# EasyEDA Pro project ProPrj_2026_05_15_drone_2026-05-23.epro

# Schematic Schematic1
Board Name: Board1; Create Date: 2026-05-15; Page Name: P1; Project Name: 2026_05_15_drone; Schematic Name: Schematic1; Update Date: 2026-05-15; Company: EasyEDA.com; Page Size: A4; Version: V1.0
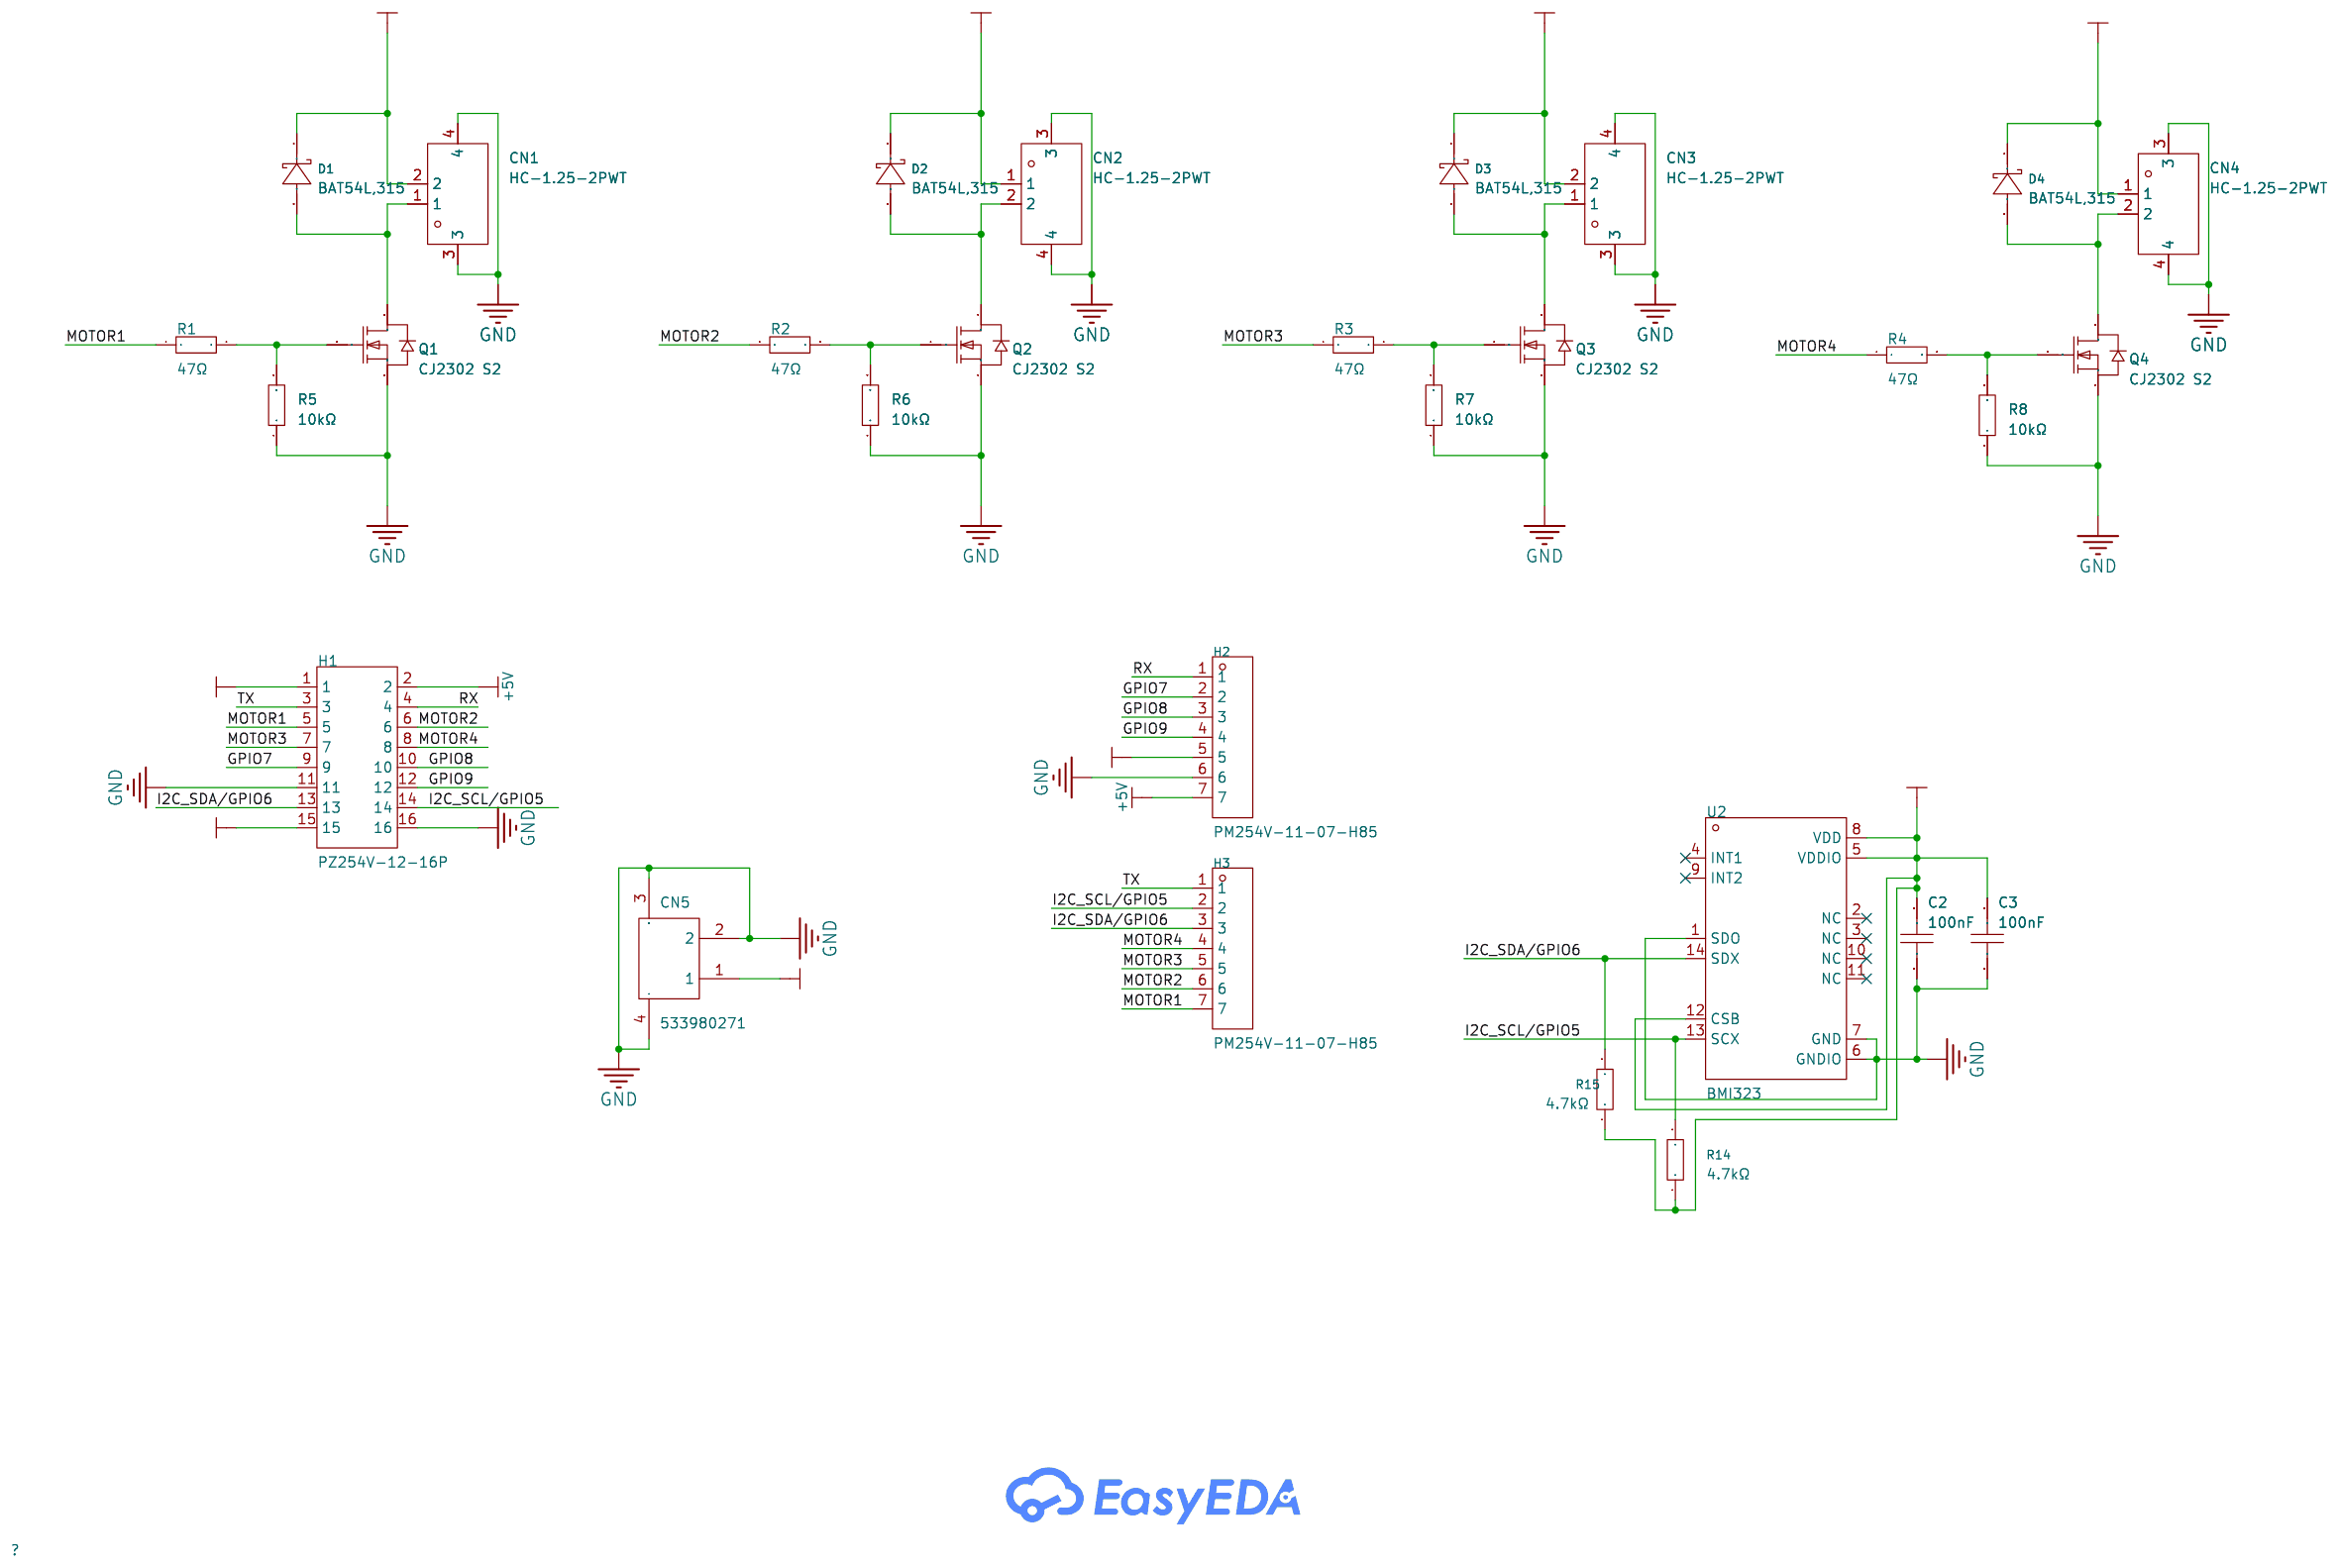
[diagram p0: schematic sheet]

## Parts
C2  100nF  [C0402]
C3  100nF  [C0402]
CN1  HC-1.25-2PWT  [CONN-SMD_2P-P1.25-HC-1.25-2PWT]
CN2  HC-1.25-2PWT  [CONN-SMD_2P-P1.25-HC-1.25-2PWT]
CN3  HC-1.25-2PWT  [CONN-SMD_2P-P1.25-HC-1.25-2PWT]
CN4  HC-1.25-2PWT  [CONN-SMD_2P-P1.25-HC-1.25-2PWT]
CN5  533980271  [CONN-SMD_2P-P1.25_053398-0X71]
D1  BAT54L,315  [DFN1006-2L-RD]
D2  BAT54L,315  [DFN1006-2L-RD]
D3  BAT54L,315  [DFN1006-2L-RD]
D4  BAT54L,315  [DFN1006-2L-RD]
H1  PZ254V-12-16P  [HDR-TH_16P-P2.54-V-M-R2-C8-S2.54]
H2  PM254V-11-07-H85  [HDR-TH_7P-P2.54-V-F]
H3  PM254V-11-07-H85  [HDR-TH_7P-P2.54-V-F]
Q1  CJ2302 S2  [SOT-23-3_L3.0-W1.7-P0.95-LS2.9-BR]
Q2  CJ2302 S2  [SOT-23-3_L3.0-W1.7-P0.95-LS2.9-BR]
Q3  CJ2302 S2  [SOT-23-3_L3.0-W1.7-P0.95-LS2.9-BR]
Q4  CJ2302 S2  [SOT-23-3_L3.0-W1.7-P0.95-LS2.9-BR]
R1  47Ω  [R0402]
R2  47Ω  [R0402]
R3  47Ω  [R0402]
R4  47Ω  [R0402]
R5  10kΩ  [R0402]
R6  10kΩ  [R0402]
R7  10kΩ  [R0402]
R8  10kΩ  [R0402]
R14  4.7kΩ  [R0402]
R15  4.7kΩ  [R0402]
U2  BMI323  [LGA-14_L3.0-W2.5-P0.50-TL_QMI8658A]

## Library data of the parts
C2 C3 = CL05B104KO5NNNC: Capacitance: Tolerance:±10% Tolerance:±10% Voltage Rated: Temperature Coefficient:; LCSC Part Name: 100nF ±10% 16V; Supplier Part: C1525; Manufacturer: SAMSUNG(三星); Supplier Footprint: 0402; JLCPCB Part Class: Basic Part; Datasheet: https://atta.szlcsc.com/upload/public/pdf/source/20160218/1457707763339.pdf; Supplier: LCSC; Tolerance: ±10%
CN1-CN4 = HC-1.25-2PWT: Pins Structure:1x2P Pitch:1.25mm Mounting Style:Horizontal attachment Reference Series:PicoBlade(MX 1.25) Number of Pins:2P Number of Rows:1 Number of PINs Per Row:2 Row Spacing:- Current Rating (Max):1A Contact Material:Brass Contact Plating:Tin Operatin; LCSC Part Name: 1x2P 间距:1.25mm 卧贴 系列:PicoBlade(MX 1.25); Supplier Part: C2845379; Manufacturer: HCTL(华灿天禄); Supplier Footprint: SMD,P=1.25mm,卧贴; JLCPCB Part Class: Extended Part; Datasheet: https://atta.szlcsc.com/upload/public/pdf/source/20240930/9508A8292CCC87B0C29E3A028D56E30A.pdf; Supplier: LCSC; Pins Structure: 1x2P; Pitch: 1.25mm; Mounting Style: Horizontal attachment; Reference Series: PicoBlade(MX 1.25); Number of Pins: 2P; Number of Rows: 1; Number of PINs Per Row: 2; Current Rating (Max): 1A; Contact Material: Brass; Contact Plating: Tin; Operating Temperature Range: -40℃~+105℃; Rated Voltage (Max): 125V; Plastic Material: LCP; Flame Retardant Rating: UL94V-0; Supplementary Features: Auxiliary soldering legs; Z-Height of the Board: 3.57mm; X-Length of Bottom Edge on Board (Spacing Line): 7.55mm; Y-Width of Bottom Edge on Board: 5.25mm
CN5 = 533980271_C122410: Pins Structure:1x2P Pitch:1.25mm Mounting Type:Surface Mount,Vertical Reference Series:PicoBlade(MX 1.25) Number of Pins:2P Number of Rows:1 Number of PINs Per Row:2 Row Spacing:- Current Rating:1A Contact Material:Phosphor Bronze Contact Plating:Tin Oper; LCSC Part Name: 1x2P 间距:1.25mm 立贴 系列:PicoBlade(MX 1.25); Supplier Part: C122410; Manufacturer: MOLEX; Supplier Footprint: SMD,P=1.25mm; JLCPCB Part Class: Extended Part; Datasheet: https://www.molex.com/content/dam/molex/molex-dot-com/products/automated/en-us/salesdrawingpdf/533/53398/533980271_sd.pdf?inline; Supplier: LCSC; Pins Structure: 1x2P; Pitch: 1.25mm; Mounting Type: Surface Mount,Vertical; Reference Series: PicoBlade(MX 1.25); Number of Pins: 2P; Number of Rows: 1; Number of PINs Per Row: 2; Current Rating: 1A; Contact Material: Phosphor Bronze; Contact Plating: Tin; Operating Temperature: -40℃~+105℃; Voltage Rating: 125V; Plastic Material: Glass-Fiber Reinforced PA; Flame Retardant Rating: UL94V-0; Supplementary Features: Auxiliary Solder Pin; Color: White; Z-Height of the Board: 4.7mm; X-Length of Bottom Edge on Board (Spacing Line): 7.65mm; Y-Width of Bottom Edge on Board: 4.2mm
D1-D4 = BAT54L,315: Voltage - Forward(Vf@If):800mV@100mA Voltage - DC Reverse(Vr):30V Current - Rectified:200mA Reverse Leakage Current (Ir):2uA@25V Non-Repetitive Peak Forward Surge Current:600mA; LCSC Part Name: 电压:30V 电流:200mA; Supplier Part: C549279; Manufacturer: Nexperia(安世); Supplier Footprint: DFN1006-2; JLCPCB Part Class: Extended Part; Datasheet: https://item.szlcsc.com/datasheet/BAT54L%252C315/570347.html; Supplier: LCSC; Voltage - Forward(Vf@If): 800mV@100mA; Voltage - DC Reverse(Vr): 30V; Current - Rectified: 200mA; Reverse Leakage Current (Ir): 2uA@25V; Non-Repetitive Peak Forward Surge Current: 600mA
H1 = PZ254V-12-16P: Pin Structure:2x8P Pitch:2.54mm Row Spacing:2.54mm Circluar Pins/Square Pins:Pin Header Mounting Type:Through Hole Number of Rows:2 Number of Pins:16P Current Rating:- Voltage Rating (Max):- Length of Mating Pin:6mm Insulation Height:2.5mm Length of End C; LCSC Part Name: 2x8P 间距:2.54mm 方针 直插; Supplier Part: C492425; Manufacturer: XFCN(兴飞); Supplier Footprint: 插件,P=2.54mm; JLCPCB Part Class: Extended Part; Datasheet: https://item.szlcsc.com/datasheet/PZ254V-12-16P/502981.html; Supplier: LCSC; Pin Structure: 2x8P; Pitch: 2.54mm; Row Spacing: 2.54mm; Circluar Pins/Square Pins: Pin Header; Mounting Type: Through Hole; Number of Rows: 2; Number of Pins: 16P; Length of Mating Pin: 6mm; Insulation Height: 2.5mm; Length of End Connection Pin: 3mm; Contact Material: Brass; Operating Temperature: -40℃~+105℃; Color: Black
H2 H3 = PM254V-11-07-H85: Holes Structure:1x7P Pitch:2.54mm Row Spacing:- Circular Hole / Square Hole:Square Hole Mounting Type:Through Hole Number of Rows:1 Number of Positions:7P Current Rating:3A Voltage Rating (Max):250V Holes Direction:Top Insulation Height:- Operating Temper; LCSC Part Name: 间距:2.54mm 1x7P 直插; Supplier Part: C2832270; Manufacturer: XFCN(兴飞); Supplier Footprint: 插件,P=2.54mm; JLCPCB Part Class: Extended Part; Datasheet: https://item.szlcsc.com/datasheet/PM254V-11-07-H85/2989788.html; Supplier: LCSC; Holes Structure: 1x7P; Pitch: 2.54mm; Circular Hole / Square Hole: Square Hole; Mounting Type: Through Hole; Number of Rows: 1; Number of Positions: 7P; Current Rating: 3A; Voltage Rating (Max): 250V; Holes Direction: Top; Operating Temperature: -40℃~+105℃
Q1-Q4 = CJ2302 S2: Type:1 N-Channel Drain Source Voltage (Vdss): Continuous Drain Current (Id): Drain Source On Resistance (RDS(on)@Vgs,Id):0.115Ω@2.5V,3.1A Power Dissipation (Pd):350mW Gate Threshold Voltage (Vgs(th)@Id):1.2V@50uA Total Gate Charge (Qg@Vgs):10nC@4.5V Input; LCSC Part Name: 1个N沟道 耐压:20V 电流:2.1A; Supplier Part: C8548; Manufacturer: CJ(江苏长电/长晶); Supplier Footprint: SOT-23; JLCPCB Part Class: Extended Part; Datasheet: https://atta.szlcsc.com/upload/public/pdf/source/20130613/1457706609595.pdf; Supplier: LCSC; Type: 1 N-Channel; Drain Source On Resistance (RDS(on)@Vgs,Id): 0.115Ω@2.5V,3.1A; Power Dissipation (Pd): 350mW; Gate Threshold Voltage (Vgs(th)@Id): 1.2V@50uA; Total Gate Charge (Qg@Vgs): 10nC@4.5V; Input Capacitance (Ciss@Vds): 300pF@10V; Reverse Transfer Capacitance (Crss@Vds): 80pF@10V; Operating Temperature: -55℃~+150℃
R1-R4 = RC0402FR-0747RL: Type:Thick Film Resistor Resistance:47Ω Tolerance:±1% Tolerance:±1% Power(Watts):62.5mW Voltage-Supply(Max):50V Temperature Coefficient:±100ppm/℃ Temperature Coefficient:±100ppm/℃ Operating Temperature:-55℃~+155℃ Operating Temperature:-55℃~+155℃; LCSC Part Name: 厚膜电阻 47Ω ±1% 62.5mW; Supplier Part: C137973; Manufacturer: YAGEO(国巨); Supplier Footprint: 0402; Datasheet: https://item.szlcsc.com/datasheet/RC0402FR-0747RL/149289.html; Supplier: LCSC; Type: Thick Film Resistor; Tolerance: ±1%; Power(Watts): 62.5mW; Voltage-Supply(Max): 50V; Temperature Coefficient: ±100ppm/℃; Operating Temperature: -55℃~+155℃
R5-R8 = RC0402FR-0710KL: Type:Thick Film Resistor Resistance:10kΩ Tolerance:±1% Tolerance:±1% Power(Watts):62.5mW Voltage-Supply(Max):50V Temperature Coefficient:±100ppm/℃ Temperature Coefficient:±100ppm/℃ Operating Temperature:-55℃~+155℃ Operating Temperature:-55℃~+155℃; LCSC Part Name: 厚膜电阻 10kΩ ±1% 62.5mW; Supplier Part: C60490; Manufacturer: YAGEO(国巨); Supplier Footprint: 0402; Datasheet: https://item.szlcsc.com/datasheet/RC0402FR-0710KL/61542.html; Supplier: LCSC; Type: Thick Film Resistor; Tolerance: ±1%; Power(Watts): 62.5mW; Voltage-Supply(Max): 50V; Temperature Coefficient: ±100ppm/℃; Operating Temperature: -55℃~+155℃
R14 R15 = 0402WGF4701TCE: Type:Thick Film Resistor Resistance:4.7kΩ Tolerance:±1% Tolerance:±1% Power(Watts):62.5mW Voltage-Supply(Max):50V Temperature Coefficient:±100ppm/℃ Temperature Coefficient:±100ppm/℃ Operating Temperature:-55℃~+155℃ Operating Temperature:-55℃~+155℃; LCSC Part Name: 4.7kΩ ±1% 62.5mW 厚膜电阻; Supplier Part: C25900; Manufacturer: UNI-ROYAL(厚声); Supplier Footprint: 0402; JLCPCB Part Class: Basic Part; Datasheet: https://item.szlcsc.com/datasheet/0402WGF4701TCE/26643.html; Supplier: LCSC; Type: Thick Film Resistor; Tolerance: ±1%; Power(Watts): 62.5mW; Voltage-Supply(Max): 50V; Temperature Coefficient: ±100ppm/℃; Operating Temperature: -55℃~+155℃
U2 = BMI323: Sensor Type:Accelerometer Gyroscope Operating Temperature:-40℃~+85℃ Operating Temperature:-40℃~+85℃; LCSC Part Name: 小型多功能惯性测量单元; Supplier Part: C5368700; Manufacturer: Bosch(博世); Supplier Footprint: LGA-14; JLCPCB Part Class: Extended Part; Datasheet: https://item.szlcsc.com/datasheet/BMI323/6208337.html; Supplier: LCSC; Sensor Type: Accelerometer Gyroscope; Operating Temperature: -40℃~+85℃

## Nets
3V3: C2.2 C3.2 H1.15 H2.5 R14.1 R15.1 U2.5(VDDIO) U2.8(VDD) U2.12(CSB)
+5V: H1.2 H2.7
GND: C2.1 C3.1 CN1.3 CN1.4 CN2.3 CN2.4 CN3.3 CN3.4 CN4.3 CN4.4 CN5.2 CN5.3 CN5.4 H1.11 H1.16 H2.6 Q1.2(S) Q2.2(S) Q3.2(S) Q4.2(S) R5.1 R6.1 R7.1 R8.1 U2.1(SDO) U2.6(GNDIO) U2.7(GND)
VBAT: CN1.2 CN2.1 CN3.2 CN4.1 CN5.1 D1.1(K) D2.1(K) D3.1(K) D4.1(K) H1.1
GPIO7: H1.9 H2.2
GPIO8: H1.10 H2.3
GPIO9: H1.12 H2.4
I2C_SCL/GPIO5: H1.14 H3.2 R14.2 U2.13(SCX)
I2C_SDA/GPIO6: H1.13 H3.3 R15.2 U2.14(SDX)
MOTOR1: H1.5 H3.7 R1.1
MOTOR2: H1.6 H3.6 R2.1
MOTOR3: H1.7 H3.5 R3.1
MOTOR4: H1.8 H3.4 R4.1
RX: H1.4 H2.1
TX: H1.3 H3.1
$1N2473: Q1.1(G) R1.2 R5.2
$1N2475: CN1.1 D1.2(A) Q1.3(D)
$1N2480: Q2.1(G) R2.2 R6.2
$1N2482: CN2.2 D2.2(A) Q2.3(D)
$1N2487: Q3.1(G) R3.2 R7.2
$1N2489: CN3.1 D3.2(A) Q3.3(D)
$1N2494: Q4.1(G) R4.2 R8.2
$1N2496: CN4.2 D4.2(A) Q4.3(D)

Not connected (* = marked no-connect by the designer): U2 2(NC)* 3(NC)* 4(INT1)* 9(INT2)* 10(NC)* 11(NC)*

# Board PCB1
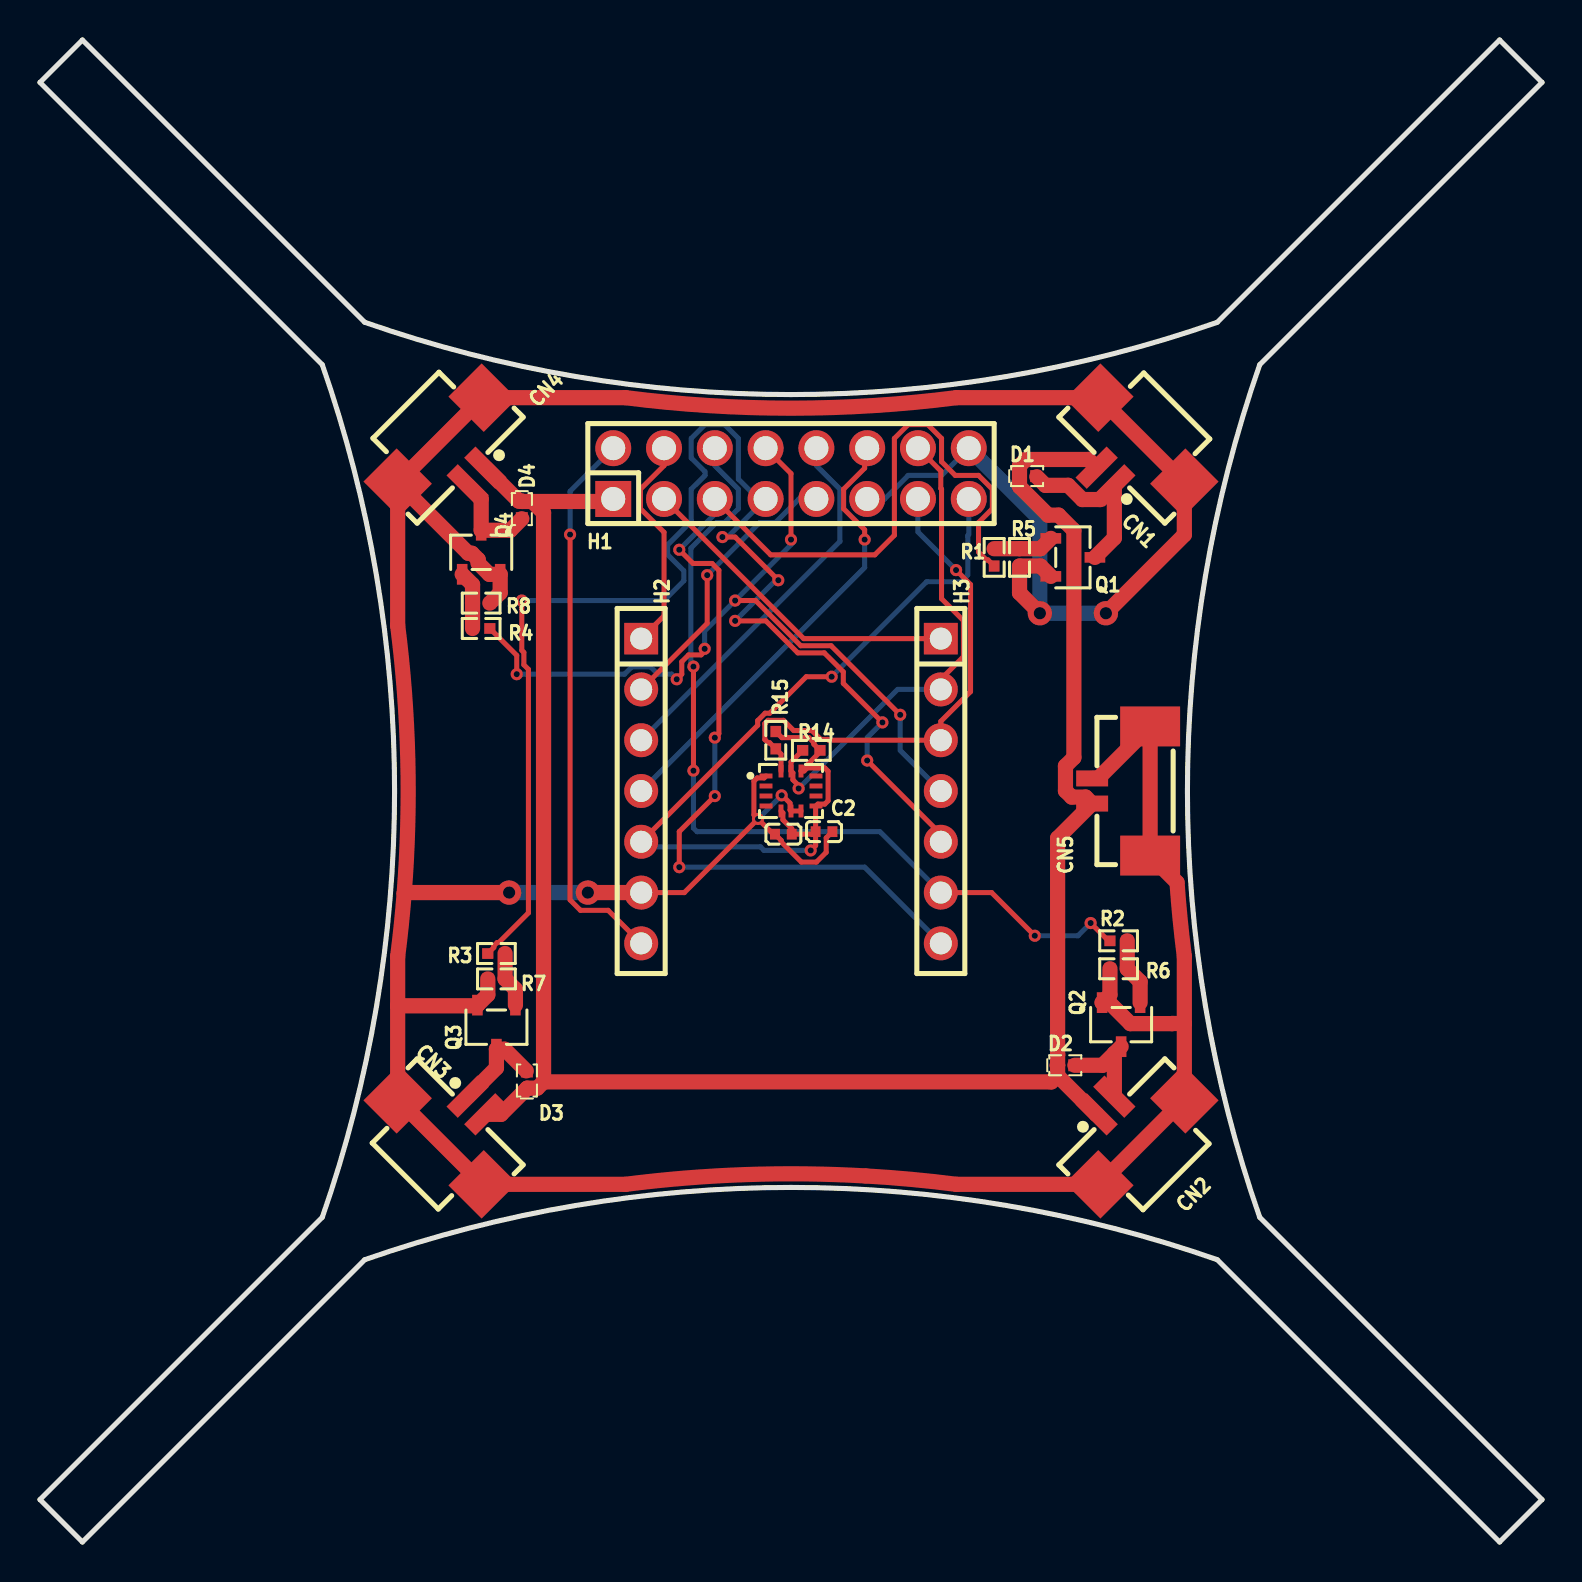
[diagram p1: board, top side]
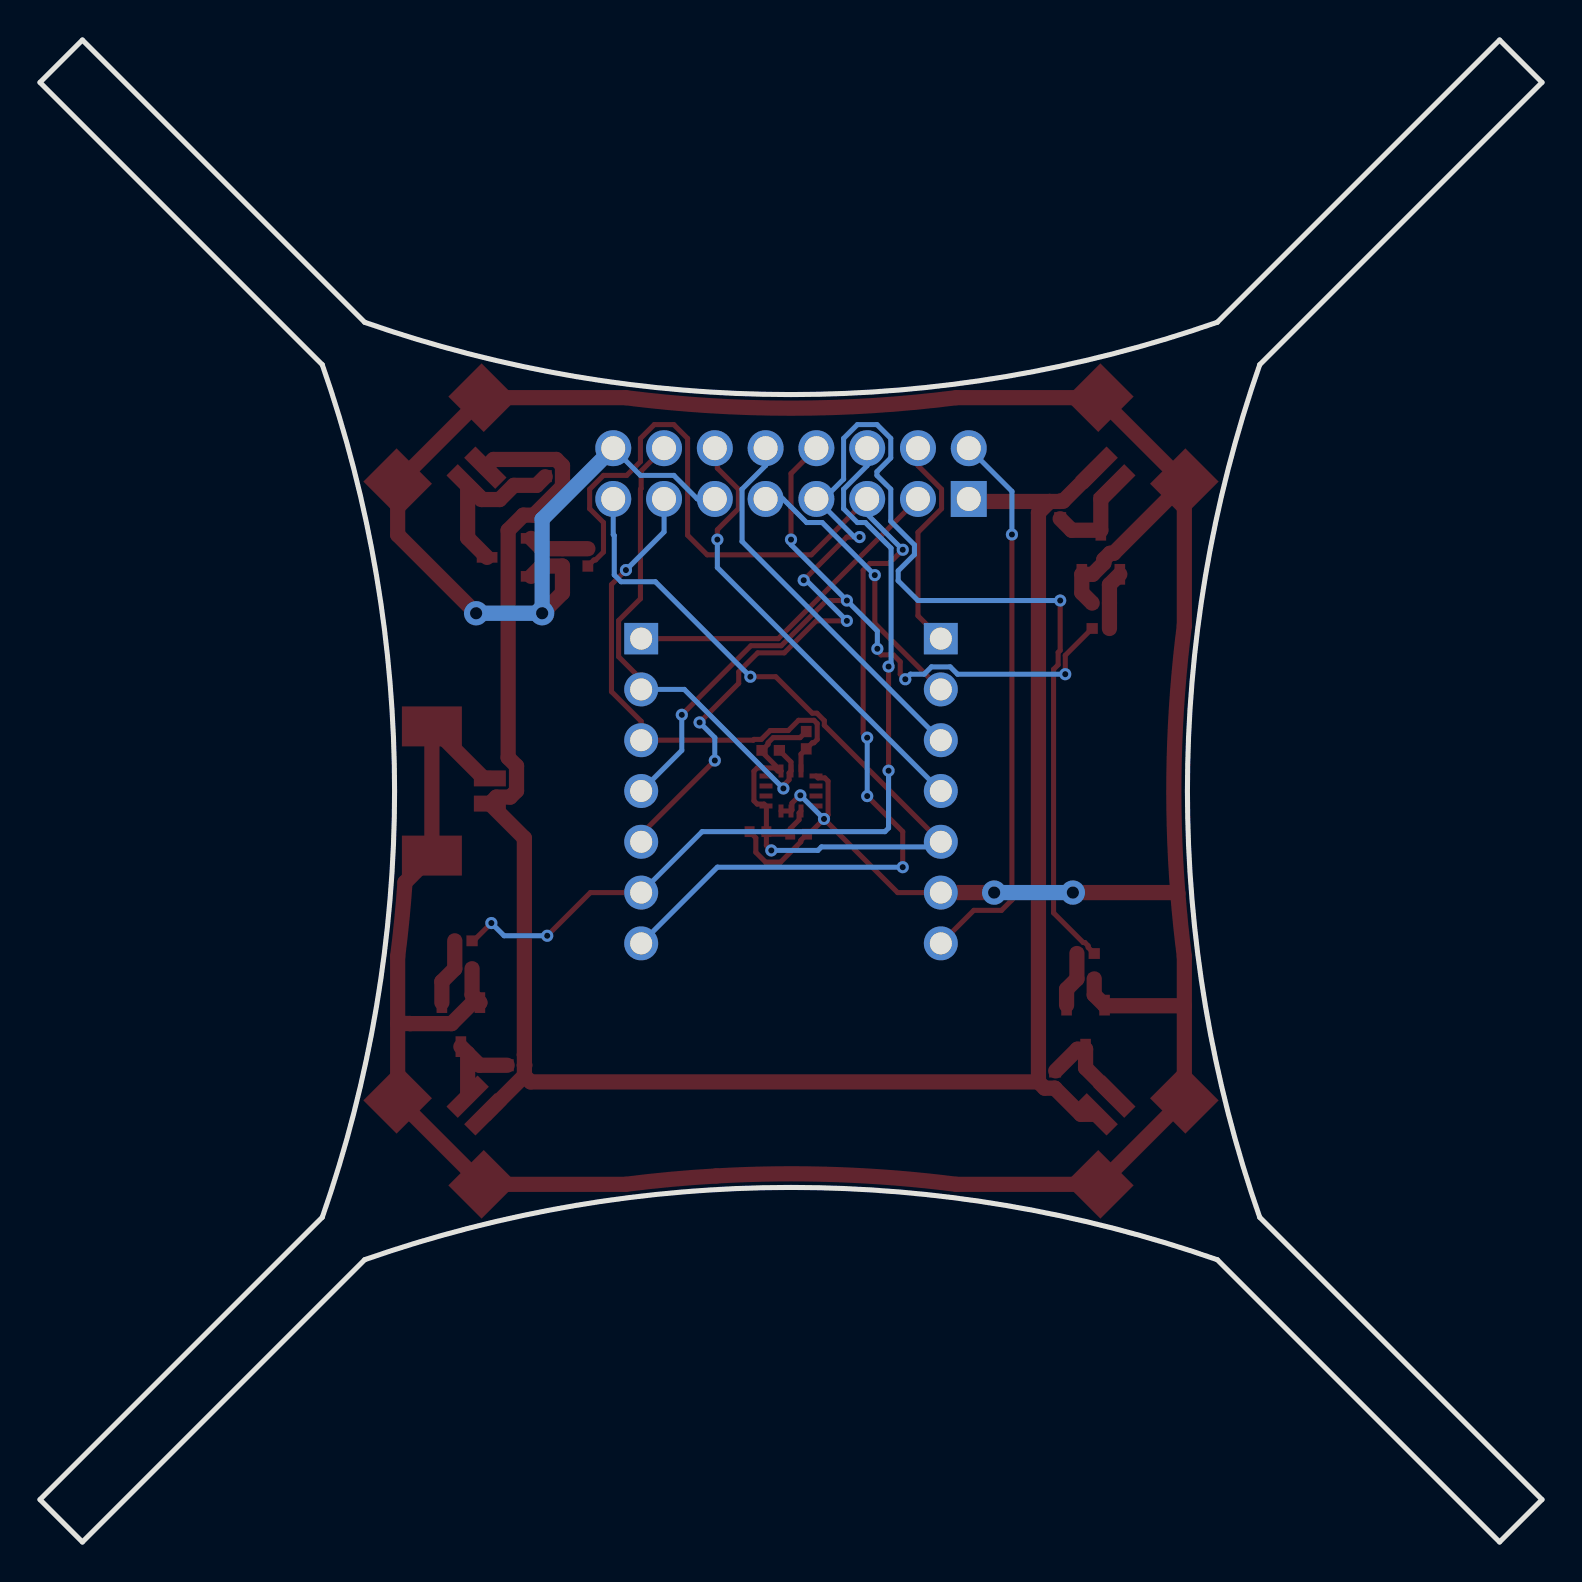
[diagram p2: board, bottom side, seen from below]

Outline 75.12 x 75.12 mm; copper layers: Top Layer, Bottom Layer. Coordinates in mm from the lower left corner of the outline.
Outline path: 0,73 2.12,75.12 16.24,61 arc(37.56,57.38) 58.88,61 73,75.12 75.12,73 61,58.88 arc(57.39,37.56) 61,16.24 75.12,2.12 73,0 58.88,14.12 arc(37.56,17.73) 16.24,14.12 2.12,0 0,2.12 14.12,16.24 arc(17.73,37.56) 14.12,58.88 0,73
Stack: Top Layer 0.035mm / Dielectric1 1.51mm FR4 er 4.5 / Bottom Layer 0.035mm

## Design rules (mm)
template: JLCPCB Capability(Two Layers Board)
spacing copperThickness1oz (default): track to track 0.102, other pairs 0.152 to 0.3
spacing copperThickness2oz: track to track 0.203, other pairs 0.152 to 0.3
track width copperThickness1oz (default): min 0.127, default 0.254, max 2.54
track width copperThickness2oz: min 0.203, default 0.254, max 2.54
differential pair differentialPair (default): width min 0.127, default 0.254, max 2.54; gap min 0.152, default 0.152
via viaSize (default): diameter min 0.5, default 0.61, max 10; hole min 0.3, default 0.305, max 6.3

## Placement (name value [footprint] x y rotation side)
C2  100nF  [C0402]  39.21 35.53 180 top
C3  100nF  [C0402]  37.18 35.4 0 top
CN1  HC-1.25-2PWT  [CONN-SMD_2P-P1.25-HC-1.25-2PWT]  54.2 54.2 135 top
CN2  HC-1.25-2PWT  [CONN-SMD_2P-P1.25-HC-1.25-2PWT]  54.2 20.92 45 top
CN3  HC-1.25-2PWT  [CONN-SMD_2P-P1.25-HC-1.25-2PWT]  20.92 20.92 315 top
CN4  HC-1.25-2PWT  [CONN-SMD_2P-P1.25-HC-1.25-2PWT]  20.92 54.2 225 top
CN5  533980271  [CONN-SMD_2P-P1.25_053398-0X71]  54.07 37.56 90 top
D1  BAT54L,315  [DFN1006-2L-RD]  49.37 53.31 0 top
D2  BAT54L,315  [DFN1006-2L-RD]  51.28 23.84 0 top
D3  BAT54L,315  [DFN1006-2L-RD]  24.35 23.08 90 top
D4  BAT54L,315  [DFN1006-2L-RD]  24.1 51.66 270 top
H1  PZ254V-12-16P  [HDR-TH_16P-P2.54-V-M-R2-C8-S2.54]  37.56 53.43 0 top
H2  PM254V-11-07-H85  [HDR-TH_7P-P2.54-V-F]  30.07 37.56 270 top
H3  PM254V-11-07-H85  [HDR-TH_7P-P2.54-V-F]  45.05 37.56 270 top
Q1  CJ2302 S2  [SOT-23-3_L3.0-W1.7-P0.95-LS2.9-BR]  51.66 49.24 180 top
Q2  CJ2302 S2  [SOT-23-3_L3.0-W1.7-P0.95-LS2.9-BR]  54.07 25.88 90 top
Q3  CJ2302 S2  [SOT-23-3_L3.0-W1.7-P0.95-LS2.9-BR]  22.83 25.75 90 top
Q4  CJ2302 S2  [SOT-23-3_L3.0-W1.7-P0.95-LS2.9-BR]  22.06 49.5 270 top
R1  47Ω  [R0402]  47.72 49.24 90 top
R2  47Ω  [R0402]  53.94 30.07 0 top
R3  47Ω  [R0402]  22.83 29.43 0 top
R4  47Ω  [R0402]  22.06 45.69 180 top
R5  10kΩ  [R0402]  48.99 49.24 90 top
R6  10kΩ  [R0402]  53.94 28.67 0 top
R7  10kΩ  [R0402]  22.83 28.16 0 top
R8  10kΩ  [R0402]  22.06 46.96 180 top
R14  4.7kΩ  [R0402]  38.57 39.59 180 top
R15  4.7kΩ  [R0402]  36.8 40.1 270 top
U2  BMI323  [LGA-14_L3.0-W2.5-P0.50-TL_QMI8658A]  37.56 37.56 0 top

## Footprints (pads in the part's own frame, mm; a bottom-side part is the same pattern mirrored in y, then rotated)
C0402
  rect 0.5x0.54 smd: 1(-0.42,0) 2(0.42,0)
CONN-SMD_2P-P1.25-HC-1.25-2PWT
  rect 0.8x2.2 smd: 1(-0.625,1.285) 2(0.625,1.285)
  rect 2.35x2.5 smd: 3(-3.005,-1.285) 4(3.005,-1.285)
CONN-SMD_2P-P1.25_053398-0X71
  rect 0.8x1.6 smd: 1(-0.63,1.45) 2(0.63,1.45)
  rect 2x3 smd: 3(3.229,-1.45) 4(-3.229,-1.45)
DFN1006-2L-RD
  rect 0.5x0.6 smd: 1(-0.4,0) 2(0.4,0)
HDR-TH_7P-P2.54-V-F
  rect 1.575x1.7 hole 1.1: 1(-7.62,0)
  round 1.7 hole 1.1: 2(-5.08,0) 3(-2.54,0) 4(0,0) 5(2.54,0) 6(5.08,0) 7(7.62,0)
HDR-TH_16P-P2.54-V-M-R2-C8-S2.54
  rect 1.8x1.8 hole 1.2: 1(-8.89,-1.27)
  round 1.8 hole 1.2: 2(-8.89,1.27) 3(-6.35,-1.27) 4(-6.35,1.27) 5(-3.81,-1.27) 6(-3.81,1.27) 7(-1.27,-1.27) 8(-1.27,1.27) 9(1.27,-1.27) 10(1.27,1.27) 11(3.81,-1.27) 12(3.81,1.27) 13(6.35,-1.27) 14(6.35,1.27) 15(8.89,-1.27) 16(8.89,1.27)
LGA-14_L3.0-W2.5-P0.50-TL_QMI8658A
  rect 0.65x0.25 smd: 1(-1.25,0.75) 2(-1.25,0.25) 3(-1.25,-0.25) 4(-1.25,-0.75) 8(1.25,-0.75) 9(1.25,-0.25) 10(1.25,0.25) 11(1.25,0.75)
  rect 0.25x0.65 smd: 5(-0.5,-1) 6(0,-1) 7(0.5,-1) 12(0.5,1) 13(0,1) 14(-0.5,1)
R0402
  rect 0.566x0.54 smd: 1(-0.433,0) 2(0.433,0)
SOT-23-3_L3.0-W1.7-P0.95-LS2.9-BR
  rect 1.038x0.532 smd: 1(1.101,-0.95) 2(1.101,0.95) 3(-1.101,0)

## Nets
As in the schematic.

Pads without a net: U2 2 3 4 9 10 11

## Via types
v1: diameter 0.61, hole 0.305, Top Layer to Bottom Layer, 29 vias
v2: diameter 1.219, hole 0.61, Top Layer to Bottom Layer, 4 vias

## Routing (per net, layer and track width the routed paths; a pad name or vN(x,y) marks a point on that pad's centre or on a via; arc(x,y) is an arc through that point)
3V3: length 47.2
  Top Layer w0.254: C2.2 38.79,36.79 U2.8 38.91,36.91 39.25,36.91 39.41,37.07 39.41,38.55 39.25,38.71 38.37,38.71 38.21,38.56 U2.12 39.01,39.51 R14.1 38.7,39.89 38.7,39.98 38.45,40.23 37.1,40.23 36.8,40.53 ; C2.2 38.79,34.83 v1(38.54,34.59) ; C2.2 38.66,35.4 C3.2 37.6,35.67 37.16,36.12 37.16,36.46 U2.5 ; v1(39.59,43.27) 38.32,43.27 36.5,41.45 36.26,41.45 35.89,41.08 35.89,40.84 H2.5
  Bottom Layer w0.254: v1(38.54,34.59) 36.21,34.59 36.03,34.77 30.32,34.77 H2.5 ; v1(39.59,43.27) 44.34,48.02 46.06,48.02 46.4,48.37 46.4,50.33 46.45,50.39 H1.15
+5V: length 27.9
  Top Layer w0.254: v1(26.51,50.39) 26.51,32.11 27.03,31.59 28.41,31.59 H2.7
  Bottom Layer w0.254: H1.2 26.51,52.55 v1(26.51,50.39)
GND: length 223.3
  Top Layer w0.254: C2.1 39.32,35.22 39.32,34.49 38.83,34 38.08,34 37.07,35.01 37.07,35.09 C3.1 36.67,35.4 v1(35.91,36.16) ; v1(35.91,36.16) 35.7,36.36 35.7,38.05 35.87,38.21 36.21,38.21 U2.1 ; v1(35.91,36.16) 32.22,32.48 H2.6 ; v1(37.09,37.34) 37.12,37.34 37.51,36.95 37.51,36.61 U2.6 U2.7
  Top Layer w0.762: 57.23,25.93 CN2.4 CN2.3 45.83,17.89 arc(43.57,18.14) 41.3,18.31 arc(35.28,18.37) 29.29,17.89 CN3.4 CN3.3 17.89,26.82 ; 57.23,25.93 57.23,29.29 arc(57.02,31.13) 56.86,32.98 CN5.4 CN5.3 52.92,38.19 CN5.2 ; 57.23,25.93 56.62,25.93 56.61,25.92 54.53,25.92 53.48,26.98 Q2.2 53.51,27.37 R6.1 ; 18.21,32.44 18.26,32.48 v2(23.46,32.48) ; 18.21,32.44 arc(18.07,30.86) 17.89,29.29 17.89,26.82 ; 18.21,32.44 arc(18.39,39.14) 17.89,45.83 CN4.4 ; 17.89,26.82 21.84,26.82 Q3.2 22.39,27.37 R7.1 ; v2(53.31,46.45) 57.23,50.37 CN1.3 CN1.4 45.83,57.23 arc(37.56,56.7) 29.29,57.23 CN4.3 CN4.4 ; R8.1 23.01,47.47 Q4.2 22.47,48.4 21.91,48.95 21.91,49.13 21.6,49.45 21.42,49.45 CN4.4 ; v2(50,46.45) 48.99,47.47 48.99,48.81 50.04,48.81 Q1.2 ; v2(27.4,32.48) H2.6
  Bottom Layer w0.254: H1.11 42.24,52.16 43.42,53.34 45.09,53.34 H1.16 ; v1(35.91,36.16) 35.91,36.16 v1(37.09,37.34)
  Bottom Layer w0.762: H1.16 50,51.15 v2(50,46.45) v2(53.31,46.45) ; v2(23.46,32.48) v2(27.4,32.48)
VBAT: length 106.5
  Top Layer w0.762: 25.18,23.01 25.18,51.47 24.62,52.04 ; 25.18,23.01 50.58,23.01 50.89,23.32 ; 25.18,23.01 24.87,22.7 24.37,22.7 D3.1 23.06,21.39 CN3.2 ; 50.89,23.32 52.83,21.39 CN2.1 ; 50.89,23.32 50.89,23.83 D2.1 50.89,23.86 50.89,24.36 50.89,24.37 50.89,35.2 CN5.1 52.29,37.26 51.6,37.26 51.29,37.57 51.29,38.81 51.71,39.23 51.71,50.59 50.94,51.36 50.42,51.36 48.99,52.79 48.99,53.83 49.3,54.14 52.44,54.14 CN1.2 ; H1.1 28.54,52.04 24.62,52.04 ; CN4.1 23.95,52.06 D4.1 24.11,52.04 24.62,52.04
GPIO7: length 14.1
  Top Layer w0.254: v1(33.37,48.35) 33.37,45.94 H2.2
  Bottom Layer w0.254: v1(33.37,48.35) 36,50.98 36.78,50.98 37.96,52.16 H1.9
GPIO8: length 19.2
  Bottom Layer w0.254: H2.3 40.01,50.04 40.01,52.65 38.83,53.83 H1.10
GPIO9: length 22.7
  Top Layer w0.254: H1.12 41.24,54.58 41.24,53.7 40.19,52.65 40.19,51.68 41.24,50.62 v1(41.24,50.13)
  Bottom Layer w0.254: H2.4 41.24,48.73 v1(41.24,50.13)
I2C_SCL/GPIO5: length 24.9
  Top Layer w0.254: R14.2 37.56,39.01 U2.13 37.66,38.46 37.66,38.12 37.94,37.83 v1(37.94,37.69) ; H1.14 45.05,53.56 45.05,52.69 45.09,52.65 45.09,47.17 46.18,46.08 46.18,44.28 45.05,43.15 H3.2
  Bottom Layer w0.254: v1(37.94,37.69) 42.89,42.64 H3.2
I2C_SDA/GPIO6: length 25.8
  Top Layer w0.254: U2.14 37.06,39.4 R15.2 36.49,39.97 36.41,39.97 36.25,40.13 36.25,40.93 36.41,41.09 37.18,41.09 37.69,40.58 38.6,40.58 39.04,40.14 39.41,40.14 39.45,40.1 H3.3 45.05,41.04 46.54,42.53 46.54,47.88 v1(45.81,48.61)
  Bottom Layer w0.254: v1(45.81,48.61) 43.91,50.51 H1.13
MOTOR1: length 63.1
  Top Layer w0.254: v1(31.97,33.75) 31.97,35.53 v1(33.75,37.3) ; v1(31.97,49.62) 32.66,48.94 33.61,48.94 33.95,48.6 33.95,40.43 v1(33.75,40.23) ; 47.72,48.81 47.41,49.11 47.33,49.11 46.94,49.51 46.94,50.98 47.63,51.68 47.63,52.65 46.94,53.34 45.77,53.34 45.09,54.03 45.09,55.19 44.4,55.88 43.42,55.88 42.73,55.19 42.73,50.35 41.75,49.37 36.54,49.37 H1.5
  Bottom Layer w0.254: v1(31.97,49.62) 33.75,51.4 H1.5 ; v1(33.75,37.3) v1(33.75,40.23) ; H3.7 41.24,33.75 v1(31.97,33.75)
MOTOR2: length 44.4
  Top Layer w0.254: H3.6 47.59,32.48 v1(49.75,30.32) ; v1(52.54,30.95) 53.43,30.07 R2.1 ; v1(32.68,38.58) v1(32.68,43.78)
  Bottom Layer w0.254: v1(52.54,30.95) 51.91,30.32 v1(49.75,30.32) ; H3.6 42,35.53 32.86,35.53 32.68,35.71 v1(32.68,38.58) ; H1.6 33.75,53.83 34.93,52.65 34.93,51.68 34.24,50.98 33.84,50.98 32.56,49.7 32.56,43.91 v1(32.68,43.78)
MOTOR3: length 69.7
  Top Layer w0.254: H3.5 45.05,35.4 v1(41.37,39.08) ; R3.1 22.7,29.73 22.7,29.82 22.86,29.98 22.94,29.98 24.43,31.46 24.43,43.64 24.2,43.87 24.2,44.49 24.1,44.59 v1(24.1,47.08) ; v1(42.13,40.99) 40.18,42.94 40.18,43.52 39.22,44.47 37.9,44.47 36.3,46.07 v1(34.76,46.07) ; v1(36.92,48.1) 34.76,50.26 v1(34.13,50.26)
  Bottom Layer w0.254: v1(42.13,40.99) 41.37,40.23 v1(41.37,39.08) ; v1(24.1,47.08) 31.21,47.08 32.2,48.07 32.2,48.57 31.39,49.38 31.39,49.87 32.57,51.05 32.57,52.65 33.26,53.34 33.26,53.52 32.57,54.22 32.57,55.19 33.26,55.88 34.24,55.88 34.93,55.19 34.93,53.16 35.92,52.16 H1.7 34.38,50.26 v1(34.13,50.26) ; v1(36.92,48.1) 36.8,48.1 v1(34.76,46.07)
MOTOR4: length 41.3
  Top Layer w0.254: v1(43.02,41.37) 39.57,44.82 38.05,44.82 35.79,47.08 v1(34.76,47.08) ; v1(37.56,50.13) 37.56,53.43 H1.8 ; R4.1 23.84,44.34 v1(23.84,43.4) ; v1(31.84,43.15) 32.1,43.4 32.1,44.02 32.44,44.37 33.06,44.37 33.24,44.54 v1(33.24,44.67)
  Bottom Layer w0.254: v1(23.84,43.4) 29.23,43.4 29.6,43.77 30.53,43.77 30.9,43.4 31.59,43.4 v1(31.84,43.15) ; v1(43.02,41.37) 43.02,39.59 H3.4 ; v1(37.56,50.13) 37.56,49.88 v1(34.76,47.08) 33.24,45.56 v1(33.24,44.67)
RX: length 11
  Top Layer w0.254: H1.4 31.21,53.83 30.03,52.65 30.03,51.68 31.21,50.5 31.21,46.32 H2.1
TX: length 16.7
  Top Layer w0.254: H3.1 38.19,45.18 H1.3
$1N2473: length 3.1
  Top Layer w0.762: R1.2 R5.2 50.04,49.68 Q1.1
$1N2475: length 8.7
  Top Layer w0.762: 49.85,53.28 50.28,52.85 51.42,52.85 52.13,52.14 53.02,52.14 CN1.1 53.73,50.22 Q1.3
$1N2480: length 3.4
  Top Layer w0.762: Q2.1 55.02,28.02 R6.2 R2.2
$1N2482: length 4.9
  Top Layer w0.762: 53.73,24.43 53.14,23.84 51.76,23.84 ; 53.73,24.43 CN2.2 ; 53.73,24.43 Q2.3
$1N2487: length 2.8
  Top Layer w0.762: R3.2 R7.2 23.78,27.64 Q3.1
$1N2489: length 4.9
  Top Layer w0.762: 24.32,23.56 23.24,24.65 Q3.3 22.83,23.71 CN3.1
$1N2494: length 2.9
  Top Layer w0.762: 21.63,45.69 21.63,47.88 Q4.1
$1N2496: length 4.8
  Top Layer w0.762: CN4.2 22.06,52.17 Q4.3 23.52,50.6 24.1,51.17
